# EAGLE schematic SchematicDrone (EAGLE 6.5.0)
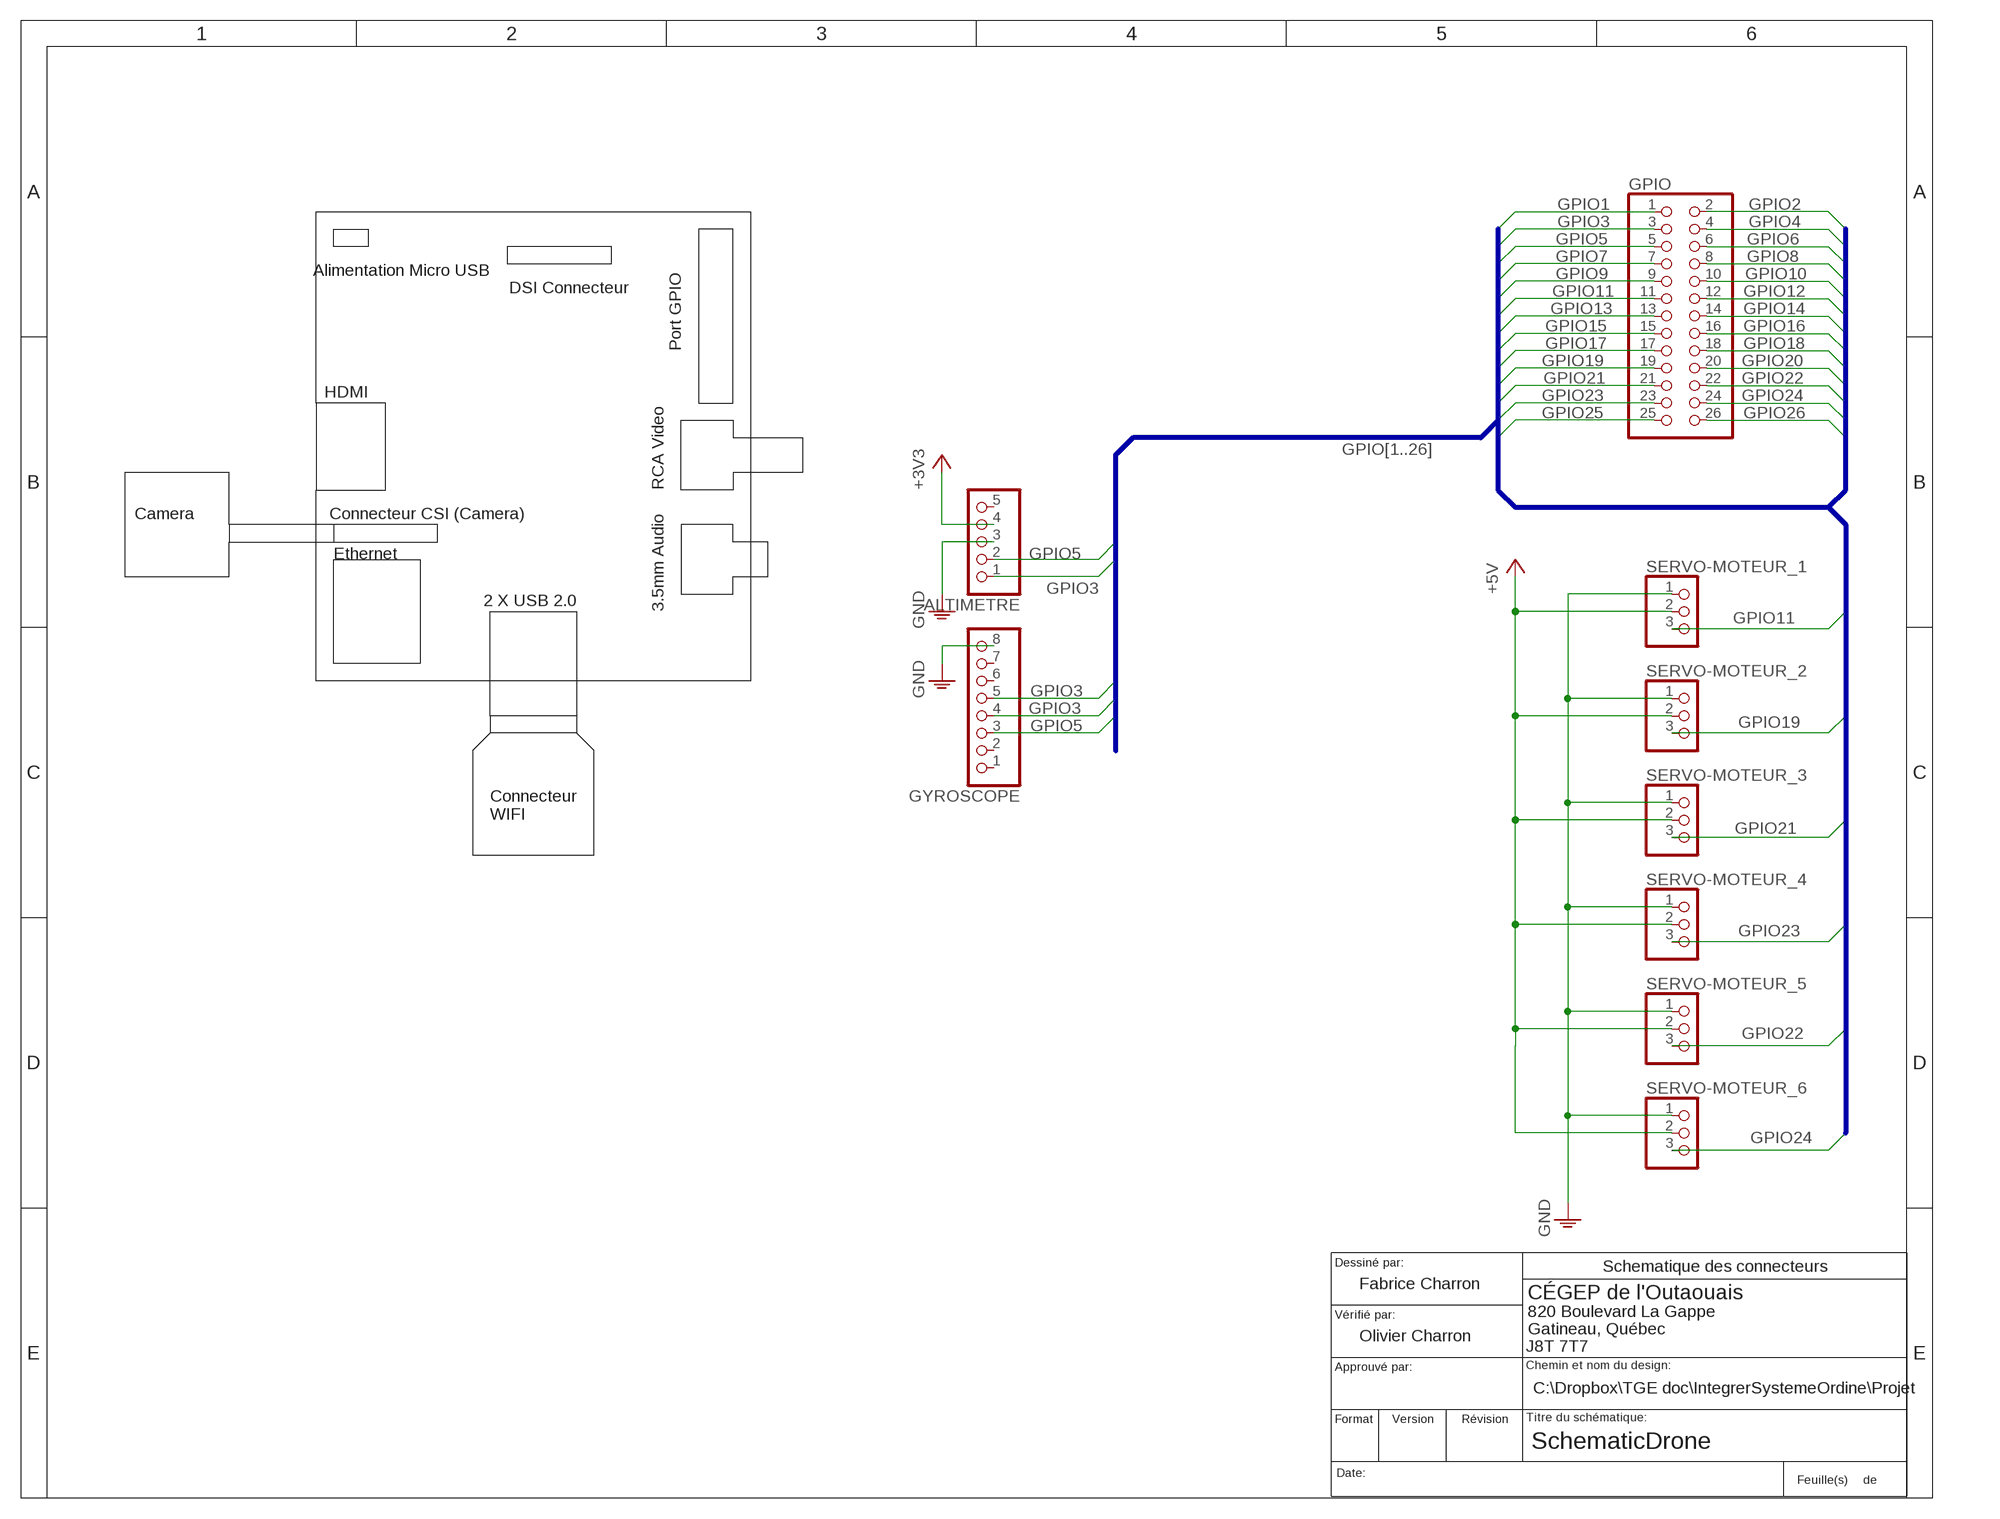
[diagram p0: schematic, sheet 1]

## Parts
ALTIMETRE  PINHD-1X5  [1X05]
GPIO  PINHD-2X13/90  [2X13/90]
GYROSCOPE  PINHD-1X8  [1X08]
SERVO-MOTEUR_1  PINHD-1X3/90  [1X03/90]
SERVO-MOTEUR_2  PINHD-1X3/90  [1X03/90]
SERVO-MOTEUR_3  PINHD-1X3/90  [1X03/90]
SERVO-MOTEUR_4  PINHD-1X3/90  [1X03/90]
SERVO-MOTEUR_5  PINHD-1X3/90  [1X03/90]
SERVO-MOTEUR_6  PINHD-1X3/90  [1X03/90]

## Nets
+3V3: ALTIMETRE.4
+5V: SERVO-MOTEUR_1.2 SERVO-MOTEUR_2.2 SERVO-MOTEUR_3.2 SERVO-MOTEUR_4.2 SERVO-MOTEUR_5.2 SERVO-MOTEUR_6.2
GPIO1: GPIO.1
GPIO2: GPIO.2
GPIO3: ALTIMETRE.1 GPIO.3 GYROSCOPE.4 GYROSCOPE.5
GPIO4: GPIO.4
GPIO5: ALTIMETRE.2 GPIO.5 GYROSCOPE.3
GPIO6: GPIO.6
GPIO7: GPIO.7
GPIO8: GPIO.8
GPIO9: GPIO.9
GPIO10: GPIO.10
GPIO11: GPIO.11 SERVO-MOTEUR_1.3
GPIO12: GPIO.12
GPIO13: GPIO.13
GPIO14: GPIO.14
GPIO15: GPIO.15
GPIO16: GPIO.16
GPIO17: GPIO.17
GPIO18: GPIO.18
GPIO19: GPIO.19 SERVO-MOTEUR_2.3
GPIO20: GPIO.20
GPIO21: GPIO.21 SERVO-MOTEUR_3.3
GPIO22: GPIO.22 SERVO-MOTEUR_5.3
GPIO23: GPIO.23 SERVO-MOTEUR_4.3
GPIO24: GPIO.24 SERVO-MOTEUR_6.3
GPIO25: GPIO.25
GPIO26: GPIO.26
PE: ALTIMETRE.3 GYROSCOPE.8 SERVO-MOTEUR_1.1 SERVO-MOTEUR_2.1 SERVO-MOTEUR_3.1 SERVO-MOTEUR_4.1 SERVO-MOTEUR_5.1 SERVO-MOTEUR_6.1 ; supply symbol labelled GND
Unconnected: ALTIMETRE.5 GYROSCOPE.1 GYROSCOPE.2 GYROSCOPE.6 GYROSCOPE.7

## Buses
GPIO[1..26]

## Notes on the sheet
- Alimentation Micro USB
- DSI Connecteur
- Port GPIO
- HDMI
- RCA Video
- Camera | Connecteur CSI (Camera)
- Ethernet
- 2 X USB 2.0
- 3.5mm Audio
- Connecteur 
  WIFI
- Schematique des connecteurs
- Fabrice Charron
- Olivier Charron
- C:\Dropbox\TGE doc\IntegrerSystemeOrdine\Projet

## Library data of the parts
ALTIMETRE = 1mylib:PINHD-1X5: PIN HEADER
GPIO = 1mylib:PINHD-2X13: PIN HEADER
GYROSCOPE = 1mylib:PINHD-1X8: PIN HEADER
SERVO-MOTEUR_1-SERVO-MOTEUR_6 = 1mylib:PINHD-1X3: PIN HEADER